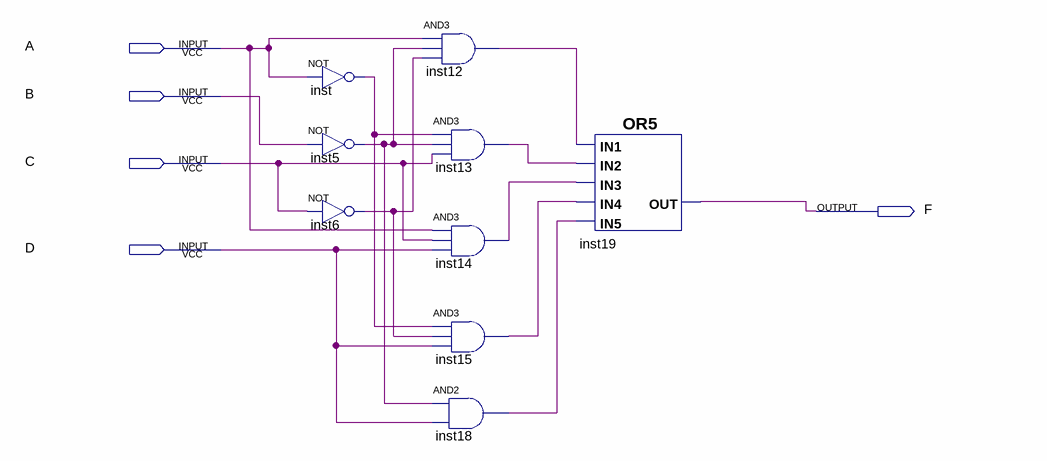
[diagram p0: schematic sheet]
// Quartus schematic w3sikao.bdf as structural Verilog: 9 symbols, 5 pins
module w3sikao (
  input  A,
  input  B,
  input  C,
  input  D,
  output F
);

  wire inst5_out, inst6_out, inst12_out, inst13_out, inst14_out, inst15_out, inst18_out, inst_out;

  not inst (inst_out, A);
  not inst5 (inst5_out, B);
  not inst6 (inst6_out, C);
  and inst12 (inst12_out, A, inst5_out, inst6_out);
  and inst13 (inst13_out, inst_out, inst5_out, C);
  and inst14 (inst14_out, A, C, D);
  and inst15 (inst15_out, inst_out, inst6_out, D);
  and inst18 (inst18_out, inst5_out, D);
  or inst19 (F, inst12_out, inst13_out, inst14_out, inst15_out, inst18_out);
endmodule
